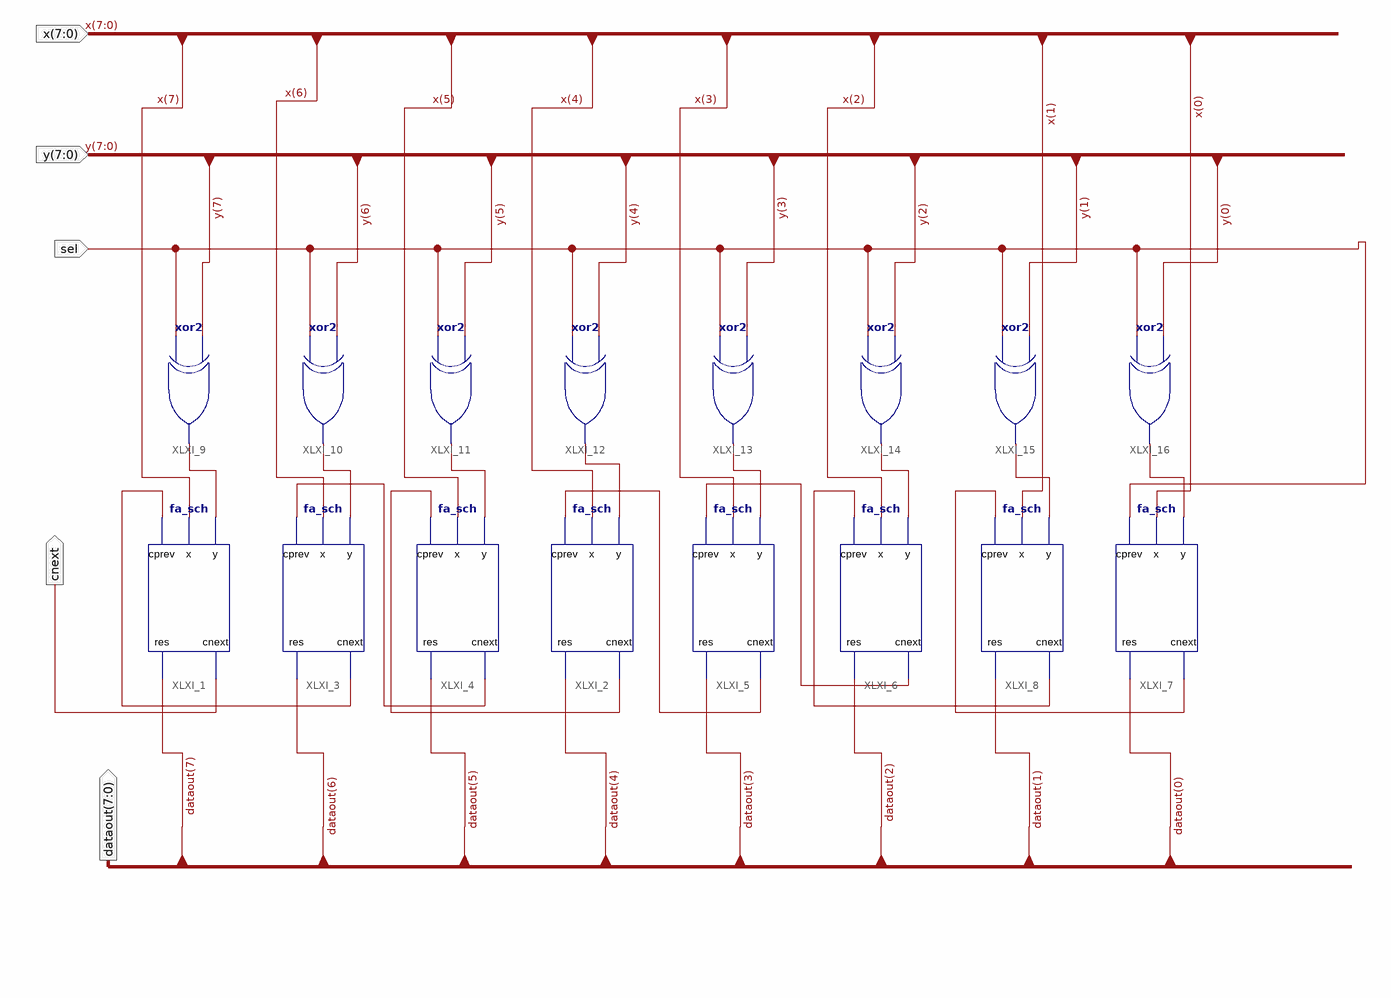
[diagram p0: schematic sheet 1]
// Xilinx ISE schematic alu_sch.sch (artix7) as structural Verilog: 16 symbols, 5 ports
module alu_sch (
  input  [7:0] x,
  input  [7:0] y,
  input  sel,
  output [7:0] dataout,
  output cnext
);

  wire XLXN_35, XLXN_37, XLXN_38, XLXN_39, XLXN_42, XLXN_43, XLXN_44, XLXN_54, XLXN_56, XLXN_58, XLXN_60,
       XLXN_62, XLXN_64, XLXN_66, XLXN_68;

  fa_sch XLXI_1 (.y(XLXN_54), .x(x[7]), .cprev(XLXN_44), .cnext(cnext), .res(dataout[7]));
  fa_sch XLXI_2 (.y(XLXN_58), .x(x[4]), .cprev(XLXN_39), .cnext(XLXN_42), .res(dataout[4]));
  fa_sch XLXI_3 (.y(XLXN_56), .x(x[6]), .cprev(XLXN_43), .cnext(XLXN_44), .res(dataout[6]));
  fa_sch XLXI_4 (.y(XLXN_60), .x(x[5]), .cprev(XLXN_42), .cnext(XLXN_43), .res(dataout[5]));
  fa_sch XLXI_5 (.y(XLXN_62), .x(x[3]), .cprev(XLXN_38), .cnext(XLXN_39), .res(dataout[3]));
  fa_sch XLXI_6 (.y(XLXN_64), .x(x[2]), .cprev(XLXN_37), .cnext(XLXN_38), .res(dataout[2]));
  fa_sch XLXI_7 (.y(XLXN_68), .x(x[0]), .cprev(sel), .cnext(XLXN_35), .res(dataout[0]));
  fa_sch XLXI_8 (.y(XLXN_66), .x(x[1]), .cprev(XLXN_35), .cnext(XLXN_37), .res(dataout[1]));
  xor XLXI_9 (XLXN_54, sel, y[7]);
  xor XLXI_10 (XLXN_56, sel, y[6]);
  xor XLXI_11 (XLXN_60, sel, y[5]);
  xor XLXI_12 (XLXN_58, sel, y[4]);
  xor XLXI_13 (XLXN_62, sel, y[3]);
  xor XLXI_14 (XLXN_64, sel, y[2]);
  xor XLXI_15 (XLXN_66, sel, y[1]);
  xor XLXI_16 (XLXN_68, sel, y[0]);
endmodule
